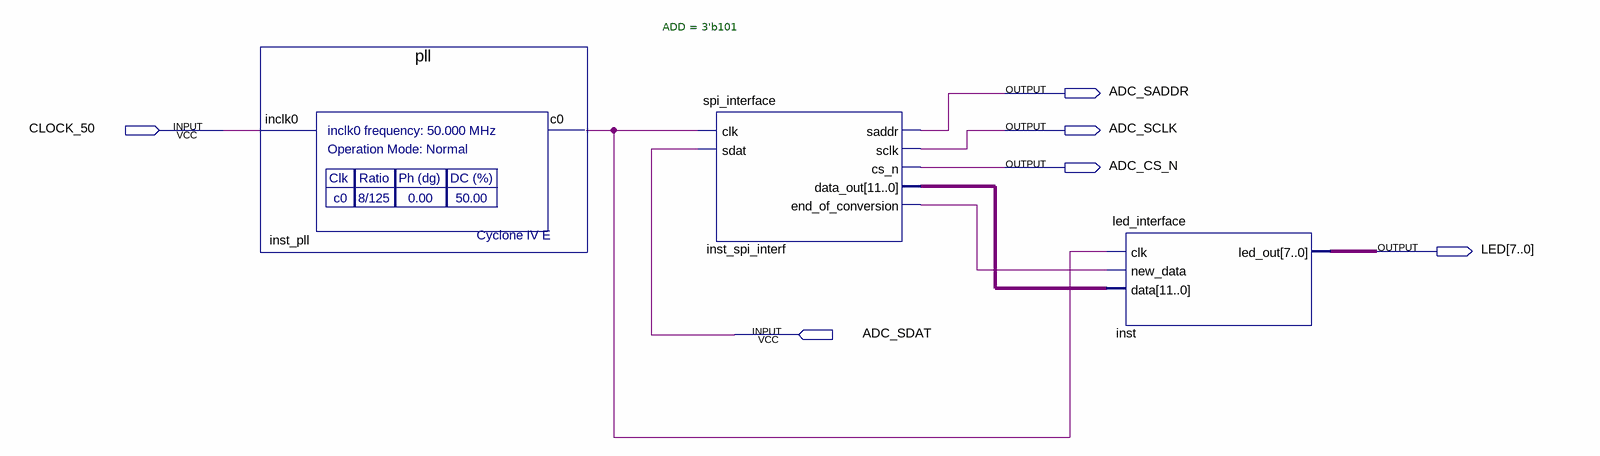
[diagram p0: schematic sheet]
// Quartus schematic Block-adc-project4dvp.bdf as structural Verilog: 3 symbols, 6 pins
module \Block-adc-project4dvp  (
  input  CLOCK_50,
  input  ADC_SDAT,
  output ADC_SADDR,
  output ADC_SCLK,
  output ADC_CS_N,
  output [7:0] LED
);

  wire inst_pll_c0, inst_spi_interf_end_of_conversion;
  wire [11:0] inst_spi_interf_data_out;

  pll inst_pll (.inclk0(CLOCK_50), .c0(inst_pll_c0));
  spi_interface #(.ADD(3'b101)) inst_spi_interf (
    .clk(inst_pll_c0), .sdat(ADC_SDAT), .saddr(ADC_SADDR), .sclk(ADC_SCLK), .cs_n(ADC_CS_N),
    .data_out(inst_spi_interf_data_out), .end_of_conversion(inst_spi_interf_end_of_conversion));
  led_interface inst (
    .clk(inst_pll_c0), .new_data(inst_spi_interf_end_of_conversion), .data(inst_spi_interf_data_out),
    .led_out(LED));
endmodule
